# Altium schematic sheet LAB_3_page2.SchDoc
size A4; SheetNumber: 2; SheetTotal: 2
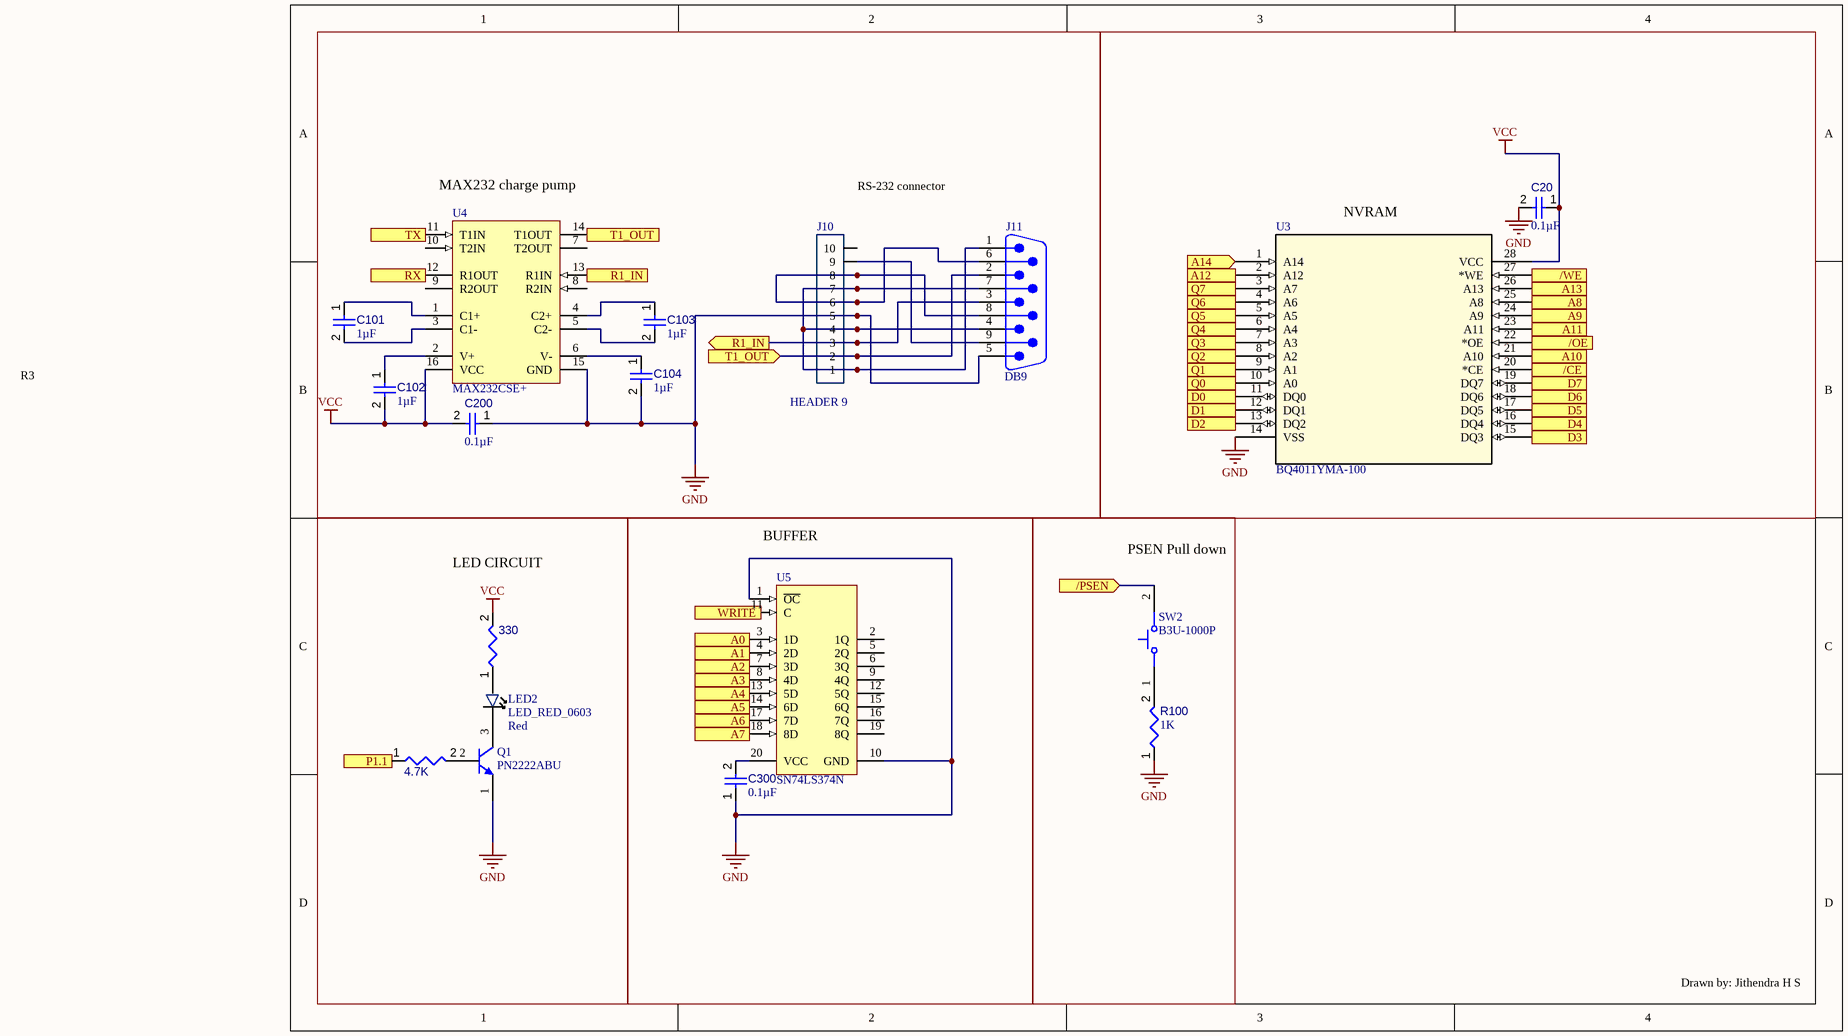
[diagram p0: LAB_3_page2.SchDoc]

## Parts
4.7K  Resistor 4k7 +/-1% 1206 250 mW  [RESC3116X70X50ML13T20]  (value not drawn)
330  Resistor 4k7 +/-1% 1206 250 mW  [RESC3116X70X50ML13T20]  (value not drawn)
C20  value 0.1µF  [CAPC2013X145X50ML20T25]  (hidden comment: Capacitor 1 uF +/- 10% 25 V 0805)
C101  value 1µF  [CAPC2013X145X50ML20T25]  (hidden comment: Capacitor 1 uF +/- 10% 25 V 0805)
C102  value 1µF  [CAPC2013X145X50ML20T25]  (hidden comment: Capacitor 1 uF +/- 10% 25 V 0805)
C103  value 1µF  [CAPC2013X145X50ML20T25]  (hidden comment: Capacitor 1 uF +/- 10% 25 V 0805)
C104  value 1µF  [CAPC2013X145X50ML20T25]  (hidden comment: Capacitor 1 uF +/- 10% 25 V 0805)
C200  value 0.1µF  [CAPC2013X145X50ML20T25]  (hidden comment: Capacitor 1 uF +/- 10% 25 V 0805)
C300  value 0.1µF  [CAPC2013X145X50ML20T25]  (hidden comment: Capacitor 1 uF +/- 10% 25 V 0805)
J10  HEADER 9  [10_PIN_100MIL-Male]
J11  DB9  [NORCO-171-009-113R911_V]
LED2  LED_RED_0603  value Red  [LED_0603]
Q1  PN2222ABU  [FAIR-TO-92]
R100  value 1K  [RESA60-630X240]  (hidden comment: MFR-25FBF52-100K)
SW2  B3U-1000P  [OMRON-B3U-1000_V]
U3  BQ4011YMA-100  [MA28]
U4  MAX232CSE+  [MAXM-S16+5_M]
U5  SN74LS374N  [N0020A]

## Blocks framed on the sheet
MAX232 charge pump: C101-C104 C200 J10 J11 U4
NVRAM: C20 U3
LED CIRCUIT: 4.7K 330 LED2 Q1
BUFFER: C300 U5
PSEN Pull down: R100 SW2

## Ports
/CE (in), /OE (in), /PSEN (in), /WE (in), A0 (in), A1 (in), A2 (in), A3 (in), A4 (in), A5 (in), A6 (in), A7 (in), A8 (in), A9 (in), A10 (in), A11 (in), A12 (in), A13 (in), A14 (in), D0 (out), D1 (out), D2 (out), D3 (out), D4 (out), D5 (out), D6 (out), D7 (out), P1.1 (in), Q0 (in), Q1 (in), Q2 (in), Q3 (in), Q4 (in), Q5 (in), Q6 (in), Q7 (in), R1_IN, R1_IN (out), RX (out), T1_OUT (in), T1_OUT (out), TX (in), WRITE (in)

## Nets
GND: C20.2 C104.2 C200.1 C300.1 J10.5 J11.5 Q1.1(E) R100.1 U3.14(VSS) U4.15(GND) U5.1(~{OC}) U5.10(GND)
VCC: 330.2 C20.1 C102.2 C200.2 U3.28(VCC) U4.16(VCC)
/CE: U3.20(*CE) ; port /CE
/OE: U3.22(*OE) ; port /OE
/PSEN: SW2.2 ; port /PSEN
/WE: U3.27(*WE) ; port /WE
A0: U5.3(1D) ; port A0
A1: U5.4(2D) ; port A1
A2: U5.7(3D) ; port A2
A3: U5.8(4D) ; port A3
A4: U5.13(5D) ; port A4
A5: U5.14(6D) ; port A5
A6: U5.17(7D) ; port A6
A7: U5.18(8D) ; port A7
A8: U3.25(A8) ; port A8
A9: U3.24(A9) ; port A9
A10: U3.21(A10) ; port A10
A11: U3.23(A11) ; port A11
A12: U3.2(A12) ; port A12
A13: U3.26(A13) ; port A13
A14: U3.1(A14) ; port A14
D0: U3.11(DQ0) ; port D0
D1: U3.12(DQ1) ; port D1
D2: U3.13(DQ2) ; port D2
D3: U3.15(DQ3) ; port D3
D4: U3.16(DQ4) ; port D4
D5: U3.17(DQ5) ; port D5
D6: U3.18(DQ6) ; port D6
D7: U3.19(DQ7) ; port D7
P1.1: 4.7K.1 ; port P1.1
Q0: U3.10(A0) ; port Q0
Q1: U3.9(A1) ; port Q1
Q2: U3.8(A2) ; port Q2
Q3: U3.7(A3) ; port Q3
Q4: U3.6(A4) ; port Q4
Q5: U3.5(A5) ; port Q5
Q6: U3.4(A6) ; port Q6
Q7: U3.3(A7) ; port Q7
R1_IN: J10.3 J11.3 U4.13(R1IN) ; port R1_IN
RX: U4.12(R1OUT) ; port RX
T1_OUT: J10.2 J11.2 U4.14(T1OUT) ; port T1_OUT
TX: U4.11(T1IN) ; port TX
Net330_1: 330.1 LED2.1
NetC101_1: C101.1 U4.1(C1+)
NetC101_2: C101.2 U4.3(C1-)
NetC102_1: C102.1 U4.2(V+)
NetC103_1: C103.1 U4.4(C2+)
NetC103_2: C103.2 U4.5(C2-)
NetC104_1: C104.1 U4.6(V-)
NetC300_2: C300.2 U5.20(VCC)
NetJ10_1: J10.1 J10.4 J10.7 J11.1 J11.4 J11.7
NetJ10_6: J10.6 J10.8 J11.6 J11.8
NetJ10_9: J10.9 J11.9
NetLED2_2: LED2.2 Q1.3(C)
NetR100_2: R100.2 SW2.1

Not connected (* = marked no-connect by the designer): 4.7K 2; J10 10; Q1 2(B); U4 7(T2OUT) 8(R2IN) 9(R2OUT) 10(T2IN); U5 2(1Q) 5(2Q) 6(3Q) 9(4Q) 11(C) 12(5Q) 15(6Q) 16(7Q) 19(8Q)

## Notes on the sheet
- RS-232 connector
- R3
- Drawn by: Jithendra H S

## Library data of the parts
4.7K 330 = CMP-009-00033-5: Chip Resistor, 4.7 KOhm, +/- 1%, 0.25 W, -55 to 155 degC, 1206 (3216 Metric); Power: 250mW; Voltage Rating: 200V; Pins: 2; Min Operating Temperature: -55°C; Max Operating Temperature: 155°C; Case/Package: 1206; Tolerance: 1%; RoHS Compliant: True; Mounting Technology: SM
C20 C101-C104 C200 C300 = CMP-001-00010-6: Chip Capacitor, 1 uF, +/-10%, 25 V, 0805 (2012 Metric); Capacitor Type: Ceramic; Voltage Rating: 25V; RoHS Compliant: True; Pins: 2; Mounting Technology: SM; Max Operating Temperature: 125°C; Min Operating Temperature: -55°C; Tolerance: 10%; Case/Package: 0805
J10 = CMP-002-00088-1: Pin Header 10 1 Straight ,180degrees 2.54mm Through Hole,P=2.54mm Pin Header & Female Header RoHS; Value: MALE; Type: Extended; Design Item ID: JM_10_PIN_MALE; LCSC Part#: C124372; Source: ECEN5730Lib_2023_05_DS.SchLib; Datasheet: https://datasheet.lcsc.com/szlcsc/1810241611_Ckmtw-Shenzhen-Cankemeng-C124372_C124372.pdf; Pins: 10; Component Type: Standard
J11 = CMP-2000-05495-1: Male Header, Pitch 2.77 mm, 2 Row, 9 Position, Height 12.52 mm, Tail Length 4.8 mm, -55 to 100 degC, RoHS, Tray; Manufacturer: Norcomp; Other Names: 171009113R9119209ME; Mating Products: 4209FE-ND-CONND-SUBRCPT9POSVERTSOLDER709FE-ND-CONNDB9CRIMPFEMALENICKEL709FER-ND-CONNDB9CRIMPFEMALETIN186-009-292L001-ND-CONNDSUBRCPT9POSSTRIDC186-009-292L551-ND-CONNDSUBRCPT9POSSTRIDC209F-ND-CONNDSUBRCPT9POSSTRSLDRCUP709F-ND-CONNDB9CRIMPFEMALETIN1709F-ND-CONNDB9CRIMPFEMYLWCHROME4209F-ND-CONND-SUBRCPT9POSVERTSOLDER1709FA-ND-CONNDB9CRIMPFEMYLWCHROME209FEA-ND-CONNDSUBRCPT9POSSTRSLDRCUP; Number of Positions: 9; Catalog Drawings: Footprint9,15,25-,37Position171,172SeriesDipSolder; Other Related Documents: 171-009-113R911MaterialDeclaration; Online Catalog: 171Series; Flange Feature: MatingSide,FemaleScrewlock(4-40); Product Training Modules: D-SubConnectors; Connector Style: D-Sub; Current Rating: 5A; Connector Type: Plug,MalePins; Associated Product: 160-09MA-ND-DUSTCOVERFORDB9MALE; 3D Model: 171-009-113Rzzz.pdf171-009-113Rzzz.stp171-009-113Rzzz.igs; Voltage Rating: -; Packaging: Tray; Operating Temperature: -50°C~100°C; Number of Rows: 2; Datasheet URL: http://www.norcomp.net/rohspdfs/Connectors/17Y/171/171-YYY-113RYY1.pdf; Housing Material: Polyamide(PA9T),Nylon9T; Color: Black; Series: 171; Mounting Technology: ThroughHole; Ingress Protection: -; Features: BoardLock,GroundingIndents; Family: D-SubConnectors; Category: Connectors,Interconnects; Termination: Solder; Shell Material, Finish: Steel,NickelPlated; Standard Package: 80; Package Description: Male Header, Pitch 2.77 mm, 2 Row, 9 Position, Height 12.52 mm, Tail Length 4.8 mm; Manufacturer URL: http://www.norcomp.net/; Mounting Type: ThroughHole; Datasheet Version: Rev. 11, 09/2015; Package Reference: 171-009-113R911; Contact Finish: Gold; Shell Size, Connector Layout: 1(DE,E); Contact Type: Signal; Contact Finish Thickness: Flash
LED2 = CMP-007-00044-1: LIGHT EMITTING DIODES (LED) RED 520~625NM 90~100MCD@20MA TOP VIEW 0603 ROHS; MFR Part #: KT-0603R; Type: Basic; Source: ECEN5730Lib_2023_05_DS.SchLib; Datasheet: https://datasheet.lcsc.com/szlcsc/Everlight-Elec-19-217-BHC-ZL1M2RY-3T_C72041.pdf; Component Type: Standard; Design Item ID: LED_RED_0603; LCSC Part#: C2286; Pins: 2
Q1 = CMP-013-00009-3: NPN General-Purpose Amplifier, 40 V, -55 to 150 degC, 3-Pin TO-92, RoHS, Bulk; Manufacturer: Fairchild; Power: 625mW; Elements: 1; hFE Min: 100; Vce Max: 1V; Frequency: 300MHz; Mounting Technology: TH; Package Quantity: 1000; RoHS Compliant: True; Datasheet Version: Rev. 1.1.0, 07/2014; Max Operating Temperature: 150°C; Min Operating Temperature: -55°C; Package Reference: TO-92; Package Description: 3-Pin Transistor Outline Package, Body Dia 4.79 mm, Pitch 1.27 mm; Pins: 3; Packaging: Bulk; Datasheet URL: https://www.fairchildsemi.com/datasheets/PN/PN2222A.pdf; Case/Package: TO-226-3
R100 = CMP-009-00045-4: Axial Resistor, 100 KOhm, +/- 1%, 0.25 W, -55 to 155 degC, 2-Pin THD, RoHS, Bulk; Manufacturer: Yageo; Power: 250mW; Voltage Rating: 250V; Case/Package: Axial; Max Operating Temperature: 155°C; Package Reference: MFR-25; Package Quantity: 200; Package Description: 2-Pin Axial Lead, Dia 2.4 mm, Body Length 6.3 mm; Tolerance: 1%; Manufacturer URL: http://www.yageo.com/; Packaging: Bulk; Mounting Technology: TH; Min Operating Temperature: -55°C; RoHS Compliant: True; Datasheet Version: Apr-13; Datasheet URL: http://www.yageo.com/documents/recent/Yageo%20LR_MFR_2013.pdf
SW2 = CMP-011-00000-2: Tactile Switch, SPST-NO, 0.05 A, 12 V, -25 to 70 degC, 2-Pin SMD, RoHS, Tape and Reel; Manufacturer: Omron Electronic Components; IP Rating: IP40; Current Rating: 50mA; Max Contact Resistance: 100mohm; Operating Force: 153gf; Throw Configuration: SPST; Resistance: 0.1Ohm; Max Voltage Rating (DC): 12V; Contact Material: Silver; Max Current Rating: 50mA; Datasheet URL: http://www.omron.com/ecb/products/pdf/en-b3u.pdf; Mounting Technology: SM; Case/Package: B3U-1000; Packaging: TapeandReel; Package Reference: B3U-1000; Manufacturer URL: http://www.omron.com/; Datasheet Version: Jan-15; RoHS Compliant: True; Max Operating Temperature: 70°C; Contact Current Rating: 50mA; Package Quantity: 3500; Package Description: 2-Pin Surface Mount Device, Body 3 x 2.5 mm; Voltage Rating (DC): 12V; Min Operating Temperature: -25°C; Voltage Rating: 12V
U3 = BQ4011YMA-100: No Description Available; Mfr_Name: Texas Instruments; Copyright: Copyright (C) 2023 Ultra Librarian. All rights reserved.; Manufacturer_Part_Number: BQ4011YMA-100; RefDes: RefDes; Type: DEV
U4 = CMP-00024-00004-2: Multichannel RS-232 Driver/Receiver, 5 V, 0 to 70 degC, 16-Pin SOIC (S16+3), RoHS, Tube; Manufacturer: Maxim; Package Version: Rev. G, 01/2016; Min Supply Voltage: 4.5V; Max Supply Voltage: 5.5V; Receivers: 2; Propagation Delay: 10us; Nominal Supply Current: 10mA; Data Rate: 120Kbps; Nominal Supply Voltage: 5V; Package URL: http://pdfserv.maximintegrated.com/package_dwgs/21-0041.PDF; Min Operating Temperature: 0°C; Datasheet URL: https://datasheets.maximintegrated.com/en/ds/MAX220-MAX249.pdf; Package Quantity: 50; Case/Package: SOIC; Package Description: 16-Pin Small Outline Integrated Circuit, Body 9.9 x 3.9 mm, Pitch 1.27 mm; Package Reference: S16+5; Interface: RS-232; Pins: 16; Manufacturer URL: http://www.maximintegrated.com/; Channels: 2; RoHS Compliant: True; Mounting Technology: SM; Packaging: Rail/Tube; Max Operating Temperature: 70°C; Datasheet Version: Rev. 17, 01/2015
U5 = CMP-1621-00373-2: Octal D-type Transparent Latches with 3-state Outputs, N0020A, TUBE; Manufacturer: Texas Instruments; Generic Part Number: SN74LS373; VCC(Min)(V): 4.75; Logic: True; Schmitt Trigger: No; Output Type: TTL; Technology Family: LS; F @ Nom Voltage(Max)(Mhz): 35; Static Current: 40; Bits(#): 8; tpd @ Nom Voltage(Max)(ns): 18; Rating: Catalog; Voltage(Nom)(V): 5; Output Drive (IOL/IOH)(Max)(mA): 24/-2.6; VCC(Max)(V): 5.25; Output Logic: Non-inverted; 3-State Output: Yes; DatasheetVersion: SDLS165B; PackageReference: N0020A; Operating Temperature Range(C): 0 to 70; ICC @ Nom Voltage(Max)(mA): 40; Code_JEDEC: MS-001; Input Type: TTL